# EAGLE design Supply switch (EAGLE 9.6.2)
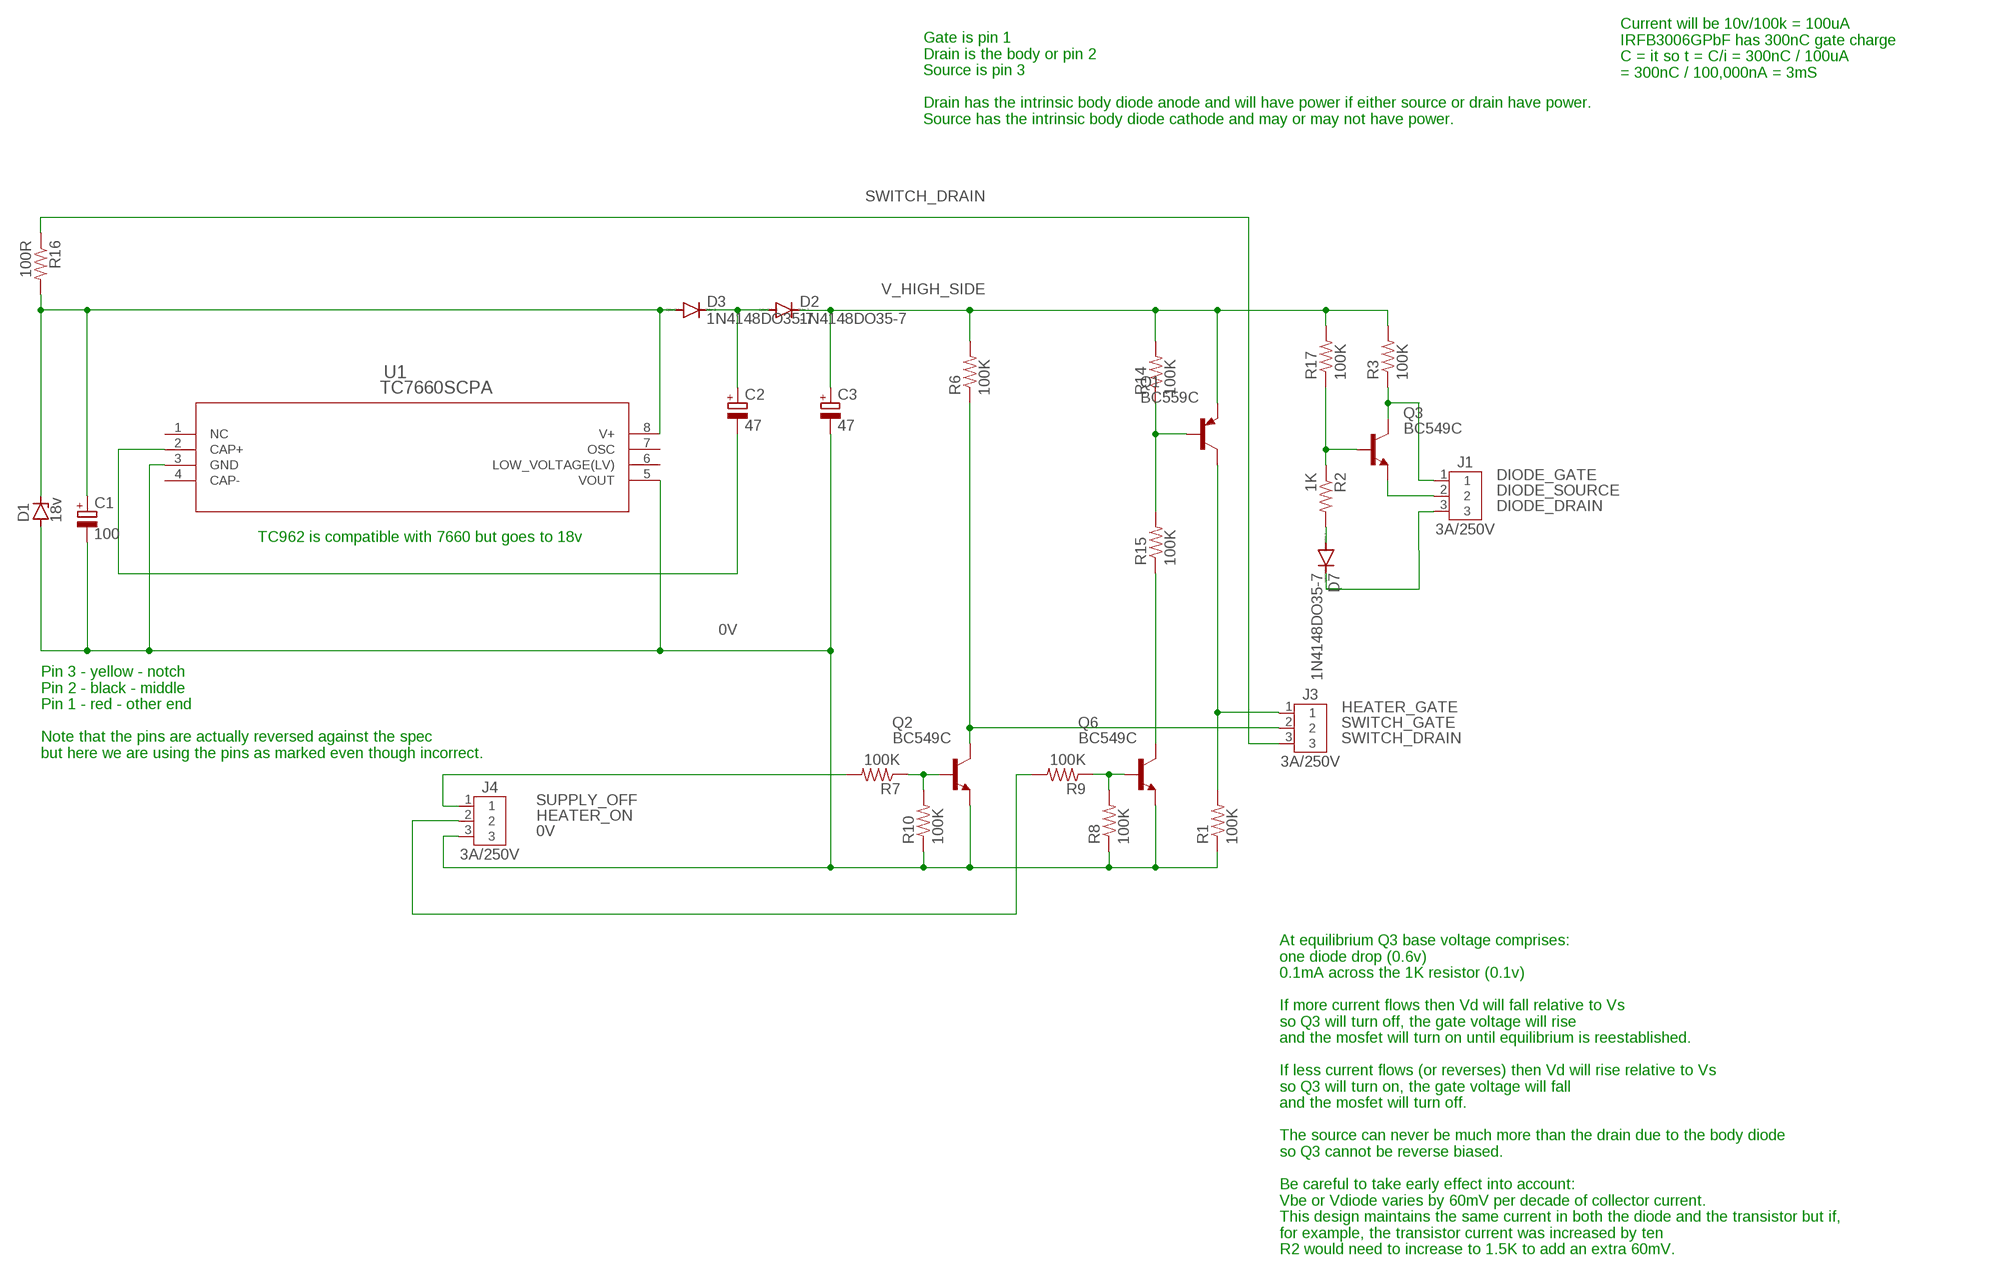
[diagram p0: schematic, sheet 1]

## Parts
C1  100  C-POL_RADIAL-11MM-DIA  [CAPPRD508W65D1000H1100B]
C2  47  C-POL_RADIAL-11MM-DIA  [CAPPRD508W65D1000H1100B]
C3  47  C-POL_RADIAL-11MM-DIA  [CAPPRD508W65D1000H1100B]
D1  18v  ZENER-DIODEF126-10  [F126Z10]
D2  1N4148DO35-7  [DO35-7]
D3  1N4148DO35-7  [DO35-7]
D7  1N4148DO35-7  [DO35-7]
J1  3A/250V  B3B-XH-A  [B3B-XH-A]
J3  3A/250V  B3B-XH-A  [B3B-XH-A]
J4  3A/250V  B3B-XH-A  [B3B-XH-A]
Q1  BC559C  [TO92-EBC]
Q2  BC549C  [TO92-EBC]
Q3  BC549C  [TO92-EBC]
Q6  BC549C  [TO92-EBC]
R1  100K  RES_7  [0204/7]
R2  1K  RES_7  [0204/7]
R3  100K  RES_7  [0204/7]
R6  100K  RES_7  [0204/7]
R7  100K  RES_7  [0204/7]
R8  100K  RES_7  [0204/7]
R9  100K  RES_7  [0204/7]
R10  100K  RES_7  [0204/7]
R14  100K  RES_7  [0204/7]
R15  100K  RES_7  [0204/7]
R16  100R  RES_7  [0204/7]
R17  100K  RES_7  [0204/7]
U1  TC7660SCPA  [PDIP8_300MC_MCH]

## Nets
0V: C1.2(-) C3.2(-) D1.A J4.3 Q2.E Q6.E R1.1 R8.1 R10.1 U1.3(GND) U1.5(VOUT)
DIODE_DRAIN: D7.C J1.3
DIODE_GATE: J1.1 Q3.C R3.1
DIODE_SOURCE: J1.2 Q3.E
HEATER_GATE: J3.1 Q1.C R1.2
HEATER_ON: J4.2 R9.2
N$1: D7.A R2.2
N$2: Q1.B R14.1 R15.2
N$3: Q6.C R15.1
N$5: Q2.B R7.1 R10.2
N$6: Q3.B R2.1 R17.1
N$9: Q6.B R8.2 R9.1
N$10: C1.1(+) D1.C D3.A R16.2 U1.8(V+)
N$12: C2.2(-) U1.2(CAP+)
N$13: C2.1(+) D2.A D3.C
SUPPLY_OFF: J4.1 R7.2
SWITCH_DRAIN: J3.3 R16.1
SWITCH_GATE: J3.2 Q2.C R6.1
V_HIGH_SIDE: C3.1(+) D2.C Q1.E R3.2 R6.2 R14.2 R17.2
Unconnected: U1.1(NC) U1.4(CAP-) U1.6(LOW_VOLTAGE(LV)) U1.7(OSC)

## Notes on the sheet
- Current will be 10v/100k = 100uA
  IRFB3006GPbF has 300nC gate charge
  C = it so t = C/i = 300nC / 100uA
  = 300nC / 100,000nA = 3mS
- Gate is pin 1
  Drain is the body or pin 2
  Source is pin 3
  
  Drain has the intrinsic body diode anode and will have power if either source or drain have power.
  Source has the intrinsic body diode cathode and may or may not have power.
- TC962 is compatible with 7660 but goes to 18v
- Pin 3 - yellow - notch
  Pin 2 - black - middle
  Pin 1 - red - other end
  
  Note that the pins are actually reversed against the spec
  but here we are using the pins as marked even though incorrect.
- At equilibrium Q3 base voltage comprises:
  one diode drop (0.6v)
  0.1mA across the 1K resistor (0.1v)
  
  If more current flows then Vd will fall relative to Vs
  so Q3 will turn off, the gate voltage will rise
  and the mosfet will turn on until equilibrium is reestablished.
  
  If less current flows (or reverses) then Vd will rise relative to Vs
  so Q3 will turn on, the gate voltage will fall
  and the mosfet will turn off.
  
  The source can never be much more than the drain due to the body diode
  so Q3 cannot be reverse biased.
  
  Be careful to take early effect into account:
  Vbe or Vdiode varies by 60mV per decade of collector current.
  This design maintains the same current in both the diode and the transistor but if,
  for example, the transistor current was increased by ten
  R2 would need to increase to 1.5K to add an extra 60mV.

## Library data of the parts
C1-C3 = Capacitor:C-POL: Capacitor Polarised - Generic; CATEGORY: Capacitor
D1 = diode:ZENER-DIODE: Z-Diode
D2 D3 D7 = diode:1N4148: DIODE high speed (Philips)
J1 J3 J4 = andrew-boyson:B3B-XH-A: XH Connector Top Entry - 3POS Details see: Datasheet <http://www.jst-mfg.com/product/pdf/eng/eXH.pdf>; CATEGORY: CONNECTOR; DESCRIPTION: 2.5mm pitch/disconnectable crimp style connector; MANUFACTURER: JST (XH connector); MPN: B3B-XH-A; PART_STATUS: ACTIVE; ROHS_COMPLIANT: COMPLIANT; SERIES: B3B-XH-A; SUB_CATEGORY: THROUGH HOLE CONNECTOR; TYPE: SIDE ENTRY
Q1 = transistor-pnp:BC559*: PNP Transistror
Q2 Q3 Q6 = transistor-npn:BC549*: NPN Transistor
R1-R3 R6-R10 R14-R17 = andrew-boyson:RES_7: RESISTOR, American symbol
U1 = andrew-boyson:TC7660SCPA; COPYRIGHT: Copyright (C) 2021 Ultra Librarian. All rights reserved.; MANUFACTURER_PART_NUMBER: TC7660SCPA; MFR_NAME: Microchip

## Board
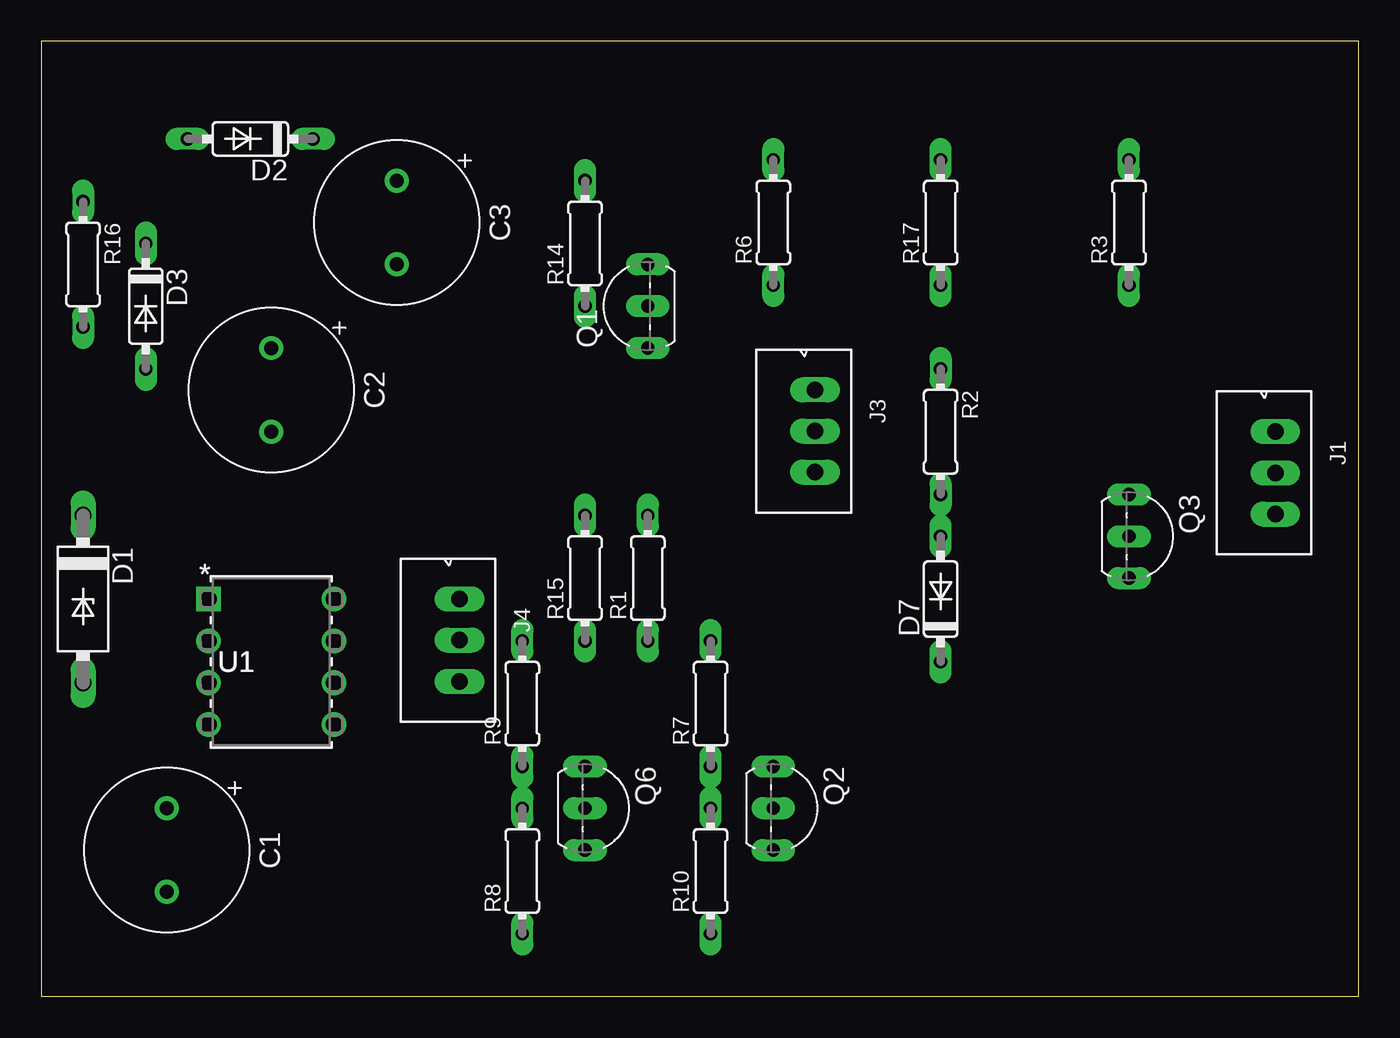
[diagram p1: board, top side]
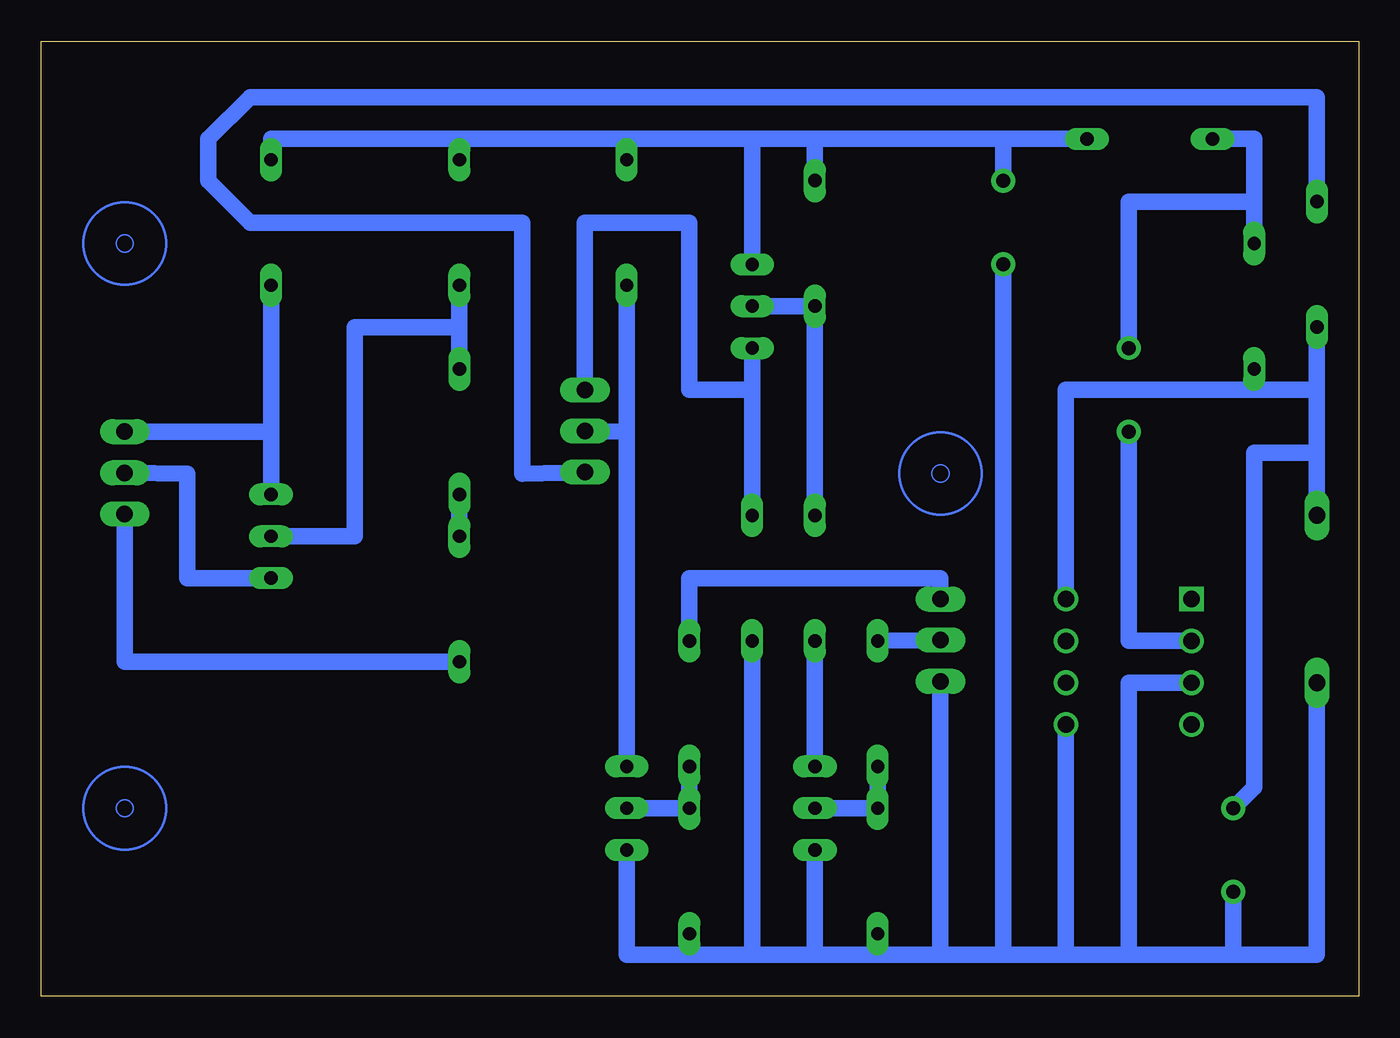
[diagram p2: board, bottom side, seen from below]

Size 80 x 58 mm. Coordinates in mm from the lower left corner, seen from the top.
Outline: 0,0 80,0 80,58 0,58 0,0
Copper layers (1*16): Top 0.035mm / dielectric 1.5mm / Bottom 0.035mm
Design rules "default": minimum track width 6mil, minimum drill 0.35mm, track to track 6mil, track to pad 6mil, pad to pad 6mil, via to via 6mil, smd to smd 6mil, copper to edge 40mil, drill to drill 6mil, minimum pad ring 10mil, minimum via ring 8mil, stop-mask expansion 4mil, vias tented up to drill 0mil, thermal gap 10mil

### Footprints (pad centres in the part's own frame; a part is rotated, then mirrored left to right if it is on the bottom)
CAPPRD508W65D1000H1100B = drill 0.85 pad 1.45: 1 -2.54,0; 2 2.54,0
F126Z10 = drill 1.016 long: A 5.08,0; C -5.08,0
DO35-7 = drill 0.813 long: A 3.81,0; C -3.81,0
B3B-XH-A = drill 1 long: 1 0,1.27; 2 2.5,1.27; 3 5,1.27
TO92-EBC = drill 0.813 long: B 0,-1.27; C -2.54,-1.27; E 2.54,-1.27
0204/7 = drill 0.813 long: 1 -3.81,0; 2 3.81,0
PDIP8_300MC_MCH = drill 0.991 pad 1.499 square: 1 0,0 | drill 0.991 pad 1.499: 2 0,-2.54; 3 0,-5.08; 4 0,-7.62; 5 7.62,-7.62; 6 7.62,-5.08; 7 7.62,-2.54; 8 7.62,0

### Placement (x,y rotation side)
C1  7.62,8.89 270 top
C2  13.97,36.83 270 top
C3  21.59,46.99 270 top
D1  2.54,24.13 270 top
D2  12.7,52.07 180 top
D3  6.35,41.91 270 top
D7  54.61,24.13 90 top
J1  73.66,34.29 270 top
J3  45.72,36.83 270 top
J4  24.13,24.13 270 top
Q1  35.56,41.91 90 top
Q2  45.72,11.43 270 top
Q3  67.31,27.94 270 top
Q6  34.29,11.43 270 top
R1  36.83,25.4 90 top
R2  54.61,34.29 270 top
R3  66.04,46.99 90 top
R6  44.45,46.99 90 top
R7  40.64,17.78 90 top
R8  29.21,7.62 90 top
R9  29.21,17.78 90 top
R10  40.64,7.62 90 top
R14  33.02,45.72 90 top
R15  33.02,25.4 90 top
R16  2.54,44.45 270 top
R17  54.61,46.99 90 top
U1  10.16,24.13 0 top

### Tracks (layer width: path | path; a pad name or v marks a point on that pad's centre or on a via)
0V
  Bottom 1.016: 33.02,2.54 36.83,2.54 | 36.83,2.54 40.64,2.54 | 40.64,2.54 44.45,2.54 Q2.E | R10.1 40.64,2.54 | 29.21,2.54 33.02,2.54 | Q6.E 33.02,2.54 | R1.1 36.83,2.54 | R8.1 29.21,2.54 | D1.A 2.54,2.54 7.62,2.54 | 7.62,2.54 13.97,2.54 | 13.97,2.54 17.78,2.54 | 17.78,2.54 21.59,2.54 | 21.59,2.54 25.4,2.54 | 25.4,2.54 29.21,2.54 | C1.2 7.62,2.54 | U1.3 13.97,19.05 13.97,2.54 | U1.5 17.78,2.54 | C3.2 21.59,2.54 | J4.3 25.4,2.54
DIODE_DRAIN
  Bottom 1.016: D7.C 74.93,20.32 J1.3
DIODE_GATE
  Bottom 1.016: 66.04,34.29 Q3.C | R3.1 66.04,34.29 | J1.1 66.04,34.29
DIODE_SOURCE
  Bottom 1.016: J1.2 71.12,31.75 71.12,25.4 Q3.E
HEATER_GATE
  Bottom 1.016: R1.2 36.83,36.83 | 36.83,36.83 Q1.C | 36.83,36.83 40.64,36.83 40.64,46.99 46.99,46.99 J3.1
HEATER_ON
  Bottom 1.016: J4.2 R9.2
N$1
  Bottom 1.016: D7.A R2.2
N$2
  Bottom 1.016: R15.2 R14.1 Q1.B
N$3
  Bottom 1.016: Q6.C R15.1
N$5
  Bottom 1.016: R7.1 R10.2 Q2.B
N$6
  Bottom 1.016: R17.1 54.61,40.64 | R2.1 54.61,40.64 | 54.61,40.64 60.96,40.64 60.96,27.94 Q3.B
N$9
  Bottom 1.016: Q6.B R8.2 R9.1
N$10
  Bottom 1.016: R16.2 2.54,36.83 | 2.54,36.83 2.54,33.02 | 2.54,33.02 D1.C | C1.1 6.35,12.7 6.35,33.02 2.54,33.02 | U1.8 17.78,36.83 6.35,36.83 | 6.35,36.83 2.54,36.83 | D3.A 6.35,36.83
N$12
  Bottom 1.016: U1.2 13.97,21.59 C2.2
N$13
  Bottom 1.016: D3.C 6.35,48.26 | 6.35,48.26 6.35,52.07 D2.A | C2.1 13.97,48.26 6.35,48.26
SUPPLY_OFF
  Bottom 1.016: R7.2 40.64,25.4 25.4,25.4 J4.1
SWITCH_DRAIN
  Bottom 1.016: R16.1 2.54,54.61 67.31,54.61 69.85,52.07 69.85,49.53 67.31,46.99 50.8,46.99 50.8,31.75 J3.3
SWITCH_GATE
  Bottom 1.016: Q2.C 44.45,34.29 | 44.45,34.29 R6.1 | J3.2 44.45,34.29
V_HIGH_SIDE
  Bottom 1.016: R3.2 66.04,52.07 54.61,52.07 | R17.2 54.61,52.07 | D2.C 21.59,52.07 | 21.59,52.07 33.02,52.07 | 33.02,52.07 36.83,52.07 | 36.83,52.07 44.45,52.07 | 44.45,52.07 54.61,52.07 | C3.1 21.59,52.07 | R14.2 33.02,52.07 | R6.2 44.45,52.07 | Q1.E 36.83,52.07
(copper drawn outside any net)
  shapes: Bottom circle x6